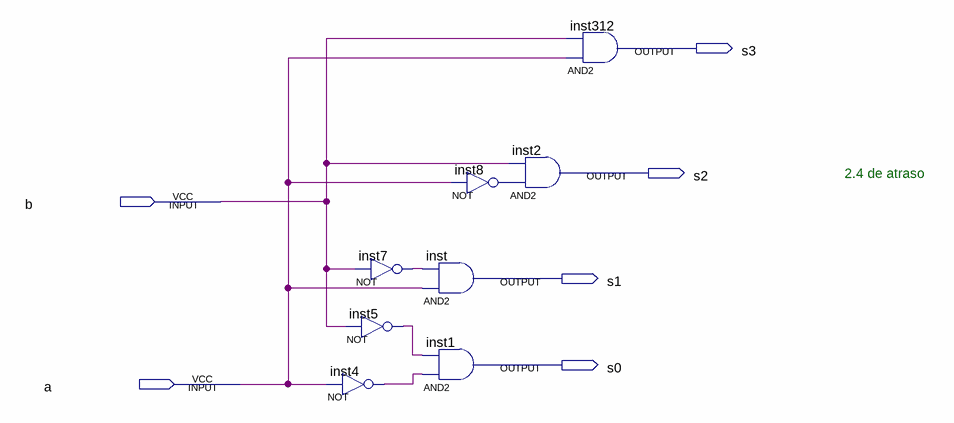
[diagram p0: schematic sheet]
// Quartus schematic DECODER2p4.bdf as structural Verilog: 8 symbols, 6 pins
module DECODER2p4 (
  input  b,
  input  a,
  output s3,
  output s2,
  output s1,
  output s0
);

  wire inst4_out, inst5_out, inst7_out, inst8_out;

  not inst4 (inst4_out, a);
  not inst7 (inst7_out, b);
  not inst5 (inst5_out, b);
  not inst8 (inst8_out, a);
  and inst (s1, a, inst7_out);
  and inst1 (s0, inst4_out, inst5_out);
  and inst2 (s2, inst8_out, b);
  // AND2 inst312 has open pins: IN1=a, IN2=b, OUT=open

  // Notes on the sheet:
  //   2.4 de atraso
endmodule
